# Altium schematic sheet CV_Beta.schdoc
size 307 x 218 mm; Symbol: Drawing-Symbol_A4; Device: Drawing-Symbol_A4; @Project Name: CV_ver0309; @Page Count: 1; @Update Date: 2025-03-09; @Create Date: 2025-03-09; @Schematic Name: Schematic1; @Page No: 1; @Page Name: P1; Company: EasyEDA.com; Version: V1.0; Page Size: A4; @Create Time: 07:45:37; @Update Time: 14:45:37; Width: 1170; Height: 825; Region Start: 1; X Region Count: 6; Y Region Count: 4; Blade Width: 10; Title Block Position: 3; @Board Name: Board1
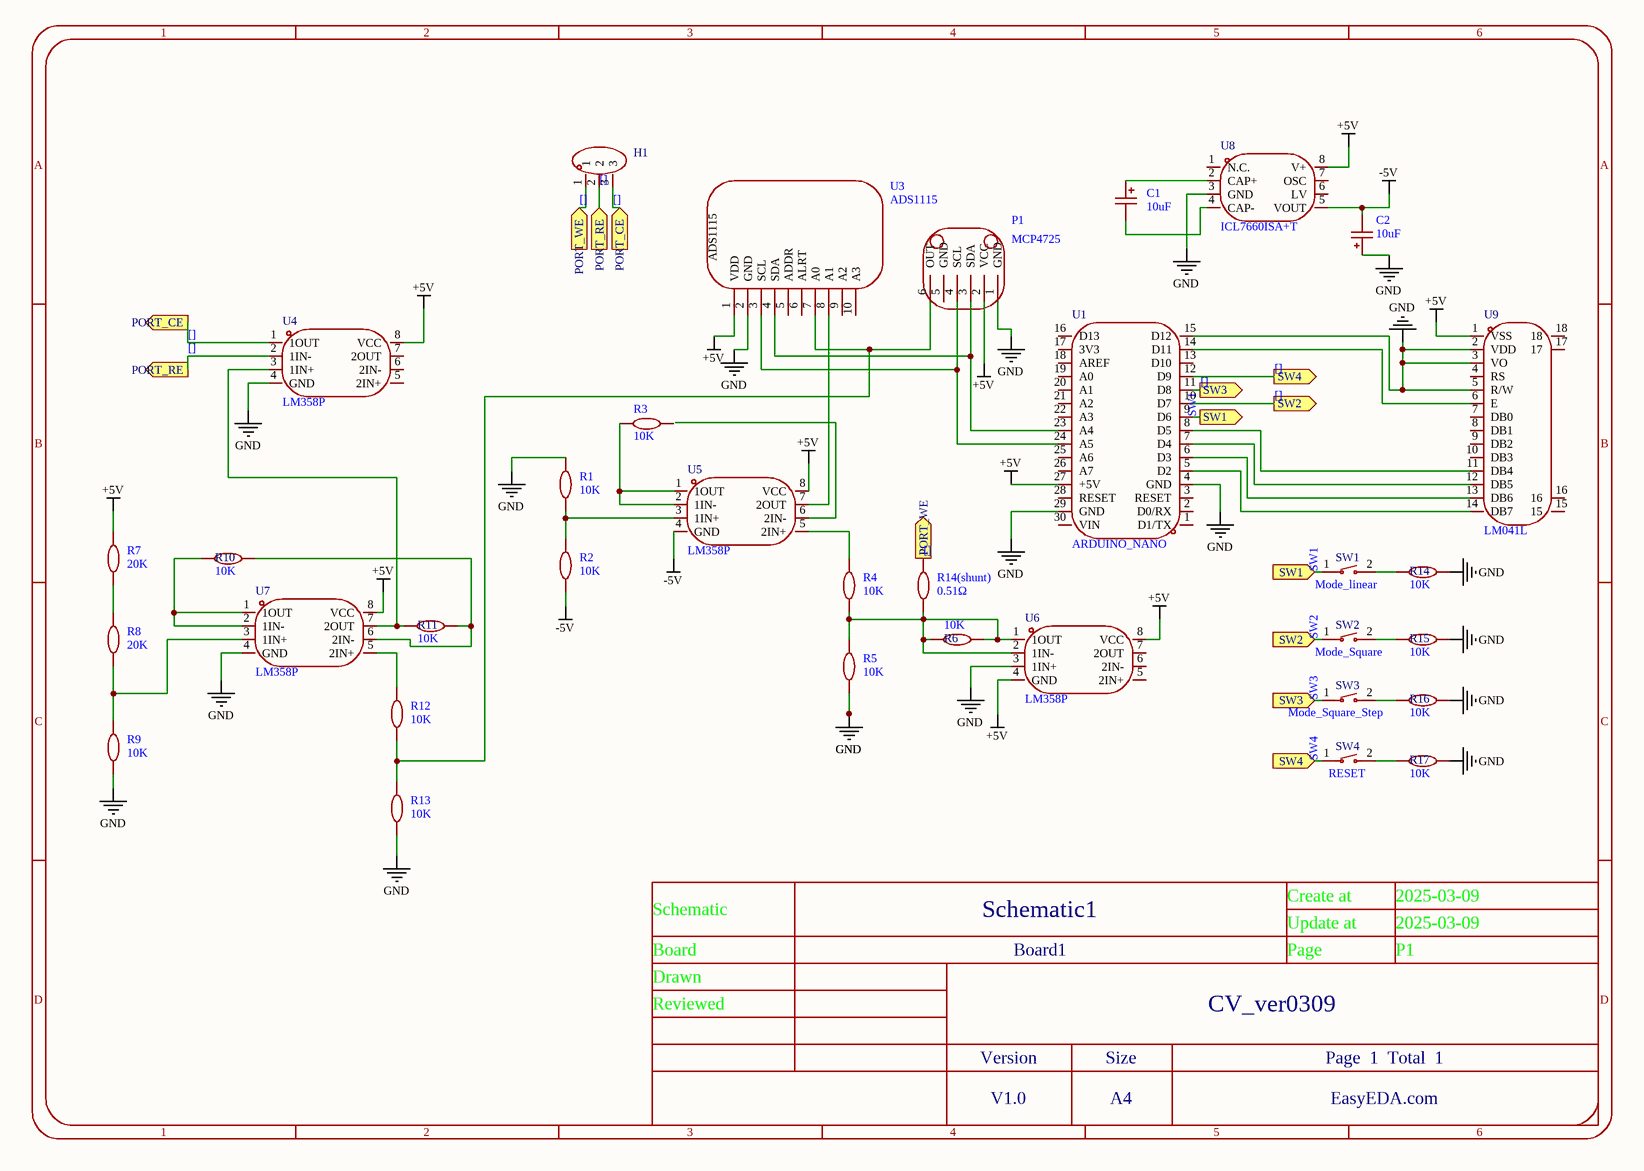
[diagram p0: CV_Beta.schdoc]

## Parts
C1  10uF  [CAP-SMD_BD3.0-L3.3-W3.3-RD]
C2  10uF  [CAP-SMD_BD3.0-L3.3-W3.3-RD]
H1  (no value)  [HDR-TH_3P-P2.54-V-F]
P1  MCP4725  [MCP4725_MODULE]
R1  10K  [R0603]
R2  10K  [R0603]
R3  10K  [R0603]
R4  10K  [R0603]
R5  10K  [R0603]
R6  10K  [R0603]
R7  20K  [R0603]
R8  20K  [R0603]
R9  10K  [R0603]
R10  10K  [R0603]
R11  10K  [R0603]
R12  10K  [R0603]
R13  10K  [R0603]
R14  10K  [R0603]
R14(shunt)  0.51Ω  [RES-TH_BD4.5-L11.5-P15.50-D0.8]
R15  10K  [R0603]
R16  10K  [R0603]
R17  10K  [R0603]
SW1  Mode_linear  [KEY-SMD_L6.0-W3.5-LS8.0]
SW2  Mode_Square  [KEY-SMD_L6.0-W3.5-LS8.0]
SW3  Mode_Square_Step  [KEY-SMD_L6.0-W3.5-LS8.0]
SW4  RESET  [KEY-SMD_L6.0-W3.5-LS8.0]
U1  ARDUINO_NANO  [COMM-TH_ARDUINO_NANO]
U3  ADS1115  [ADS1115]
U4  LM358P  [DIP-8_L9.4-W6.4-P2.54-LS9.1-BL]
U5  LM358P  [DIP-8_L9.4-W6.4-P2.54-LS9.1-BL]
U6  LM358P  [DIP-8_L9.4-W6.4-P2.54-LS9.1-BL]
U7  LM358P  [DIP-8_L9.4-W6.4-P2.54-LS9.1-BL]
U8  ICL7660ISA+T  [SOIC-8_L5.0-W4.0-P1.27-LS6.1-BL]
U9  LM041L  [LCD-TH_LM041L]

## Ports
PORT_CE (in), PORT_CE (out), PORT_RE (in), PORT_RE (out), PORT_WE (in), PORT_WE (out), SW1 (in), SW1 (out), SW2 (in), SW2 (out), SW3 (in), SW3 (out), SW4 (in), SW4 (out)

## Nets
+5V: P1.2(VCC) R7.2 U1.27(+5V) U3.1(VDD) U4.8(VCC) U5.8(VCC) U6.4(GND) U6.8(VCC) U7.8(VCC) U8.8(V+) U9.1(VSS)
-5V: C2.2 R2.1 U5.4(GND) U8.5(VOUT)
GND: C2.1 P1.1(GND) R1.2 R5.1 R9.1 R13.1 R14.2 R15.2 R16.2 R17.2 U1.4(GND) U1.15(D12) U1.29(GND) U3.2(GND) U4.4(GND) U6.3(1IN+) U7.4(GND) U8.3(GND) U9.2(VDD) U9.3(VO) U9.5(R/W)
[]: H1.1 H1.2 H1.3 R14(shunt).2 SW2.1 SW3.1 SW4.1 U1.10(D7) U1.11(D8) U1.12(D9) U4.1(1OUT) U4.2(1IN-) ; port PORT_WE, port PORT_CE, port PORT_RE, port SW2, port SW3, port SW4  [also labelled SW2, SW3, SW4]
SW1: SW1.1 U1.9(D6) ; port SW1
NetC1_1: C1.1 U8.2(CAP+)
NetC1_2: C1.2 U8.4(CAP-)
NetP1_3: P1.3(SDA) U1.23(A4) U3.4(SDA)
NetP1_4: P1.4(SCL) U1.24(A5) U3.3(SCL)
NetP1_6: P1.6(OUT) R12.1 R13.2 U3.7(A0)
NetR1_1: R1.1 R2.2 U5.3(1IN+)
NetR3_1: R3.1 U5.1(1OUT) U5.2(1IN-)
NetR4_1: R4.1 R5.2 R6.1 R6.2 R14(shunt).1 U6.1(1OUT) U6.2(1IN-)
NetR4_2: R4.2 U5.5(2IN+)
NetR7_1: R7.1 R8.2
NetR8_1: R8.1 R9.2 U7.3(1IN+)
NetR10_1: R10.1 U7.1(1OUT) U7.2(1IN-)
NetR10_2: R10.2 R11.2 U7.6(2IN-)
NetR11_1: R11.1 U4.3(1IN+) U7.7(2OUT)
NetR12_2: R12.2 U7.5(2IN+)
NetR14_1: R14.1 SW1.2
NetR15_1: R15.1 SW2.2
NetR16_1: R16.1 SW3.2
NetR17_1: R17.1 SW4.2
NetU1_5: U1.5(D2) U9.14(DB7)
NetU1_6: U1.6(D3) U9.13(DB6)
NetU1_7: U1.7(D4) U9.12(DB5)
NetU1_8: U1.8(D5) U9.11(DB4)
NetU1_14: U1.14(D11) U9.6(E)
NetU3_8: U3.8(A1) U5.7(2OUT)

Not connected (* = marked no-connect by the designer): P1 5(GND); R3 2; U1 1(D1/TX) 2(D0/RX) 3(RESET) 13(D10) 16(D13) 17(3V3) 18(AREF) 19(A0) 20(A1) 21(A2) 22(A3) 25(A6) 26(A7) 28(RESET) 30(VIN); U3 5(ADDR) 6(ALRT) 9(A2) 10(A3); U4 5(2IN+) 6(2IN-) 7(2OUT); U5 6(2IN-); U6 5(2IN+) 6(2IN-) 7(2OUT); U8 1(N.C.) 6(LV) 7(OSC); U9 4(RS) 7(DB0) 8(DB1) 9(DB2) 10(DB3) 15 16 17 18

## Notes on the sheet
- 1
- 2
- 3
- 4
- 5
- 6
- A
- B
- C
- Schematic
- Schematic1
- Create at
- Update at
- 2025-03-09
- Board
- Drawn
- Board1
- Page
- P1
- D
- Reviewed
- Version
- Size
- CV_ver0309
- Page  1  Total  1
- V1.0
- A4
- EasyEDA.com

## Library data of the parts
C1 C2 = C_Ele_SMD_3x5.4mm: Add into BOM: yes; Symbol: C_Ele_SMD; Device: C_Ele_SMD_3x5.4mm; Supplier Footprint: SMD,3x5.4mm; Convert to PCB: yes; Value: 10uF
H1 = HDR-F_2.54_1x3P: Symbol: PM254V-11-03-H85; Convert to PCB: yes; Device: HDR-F_2.54_1x3P; Add into BOM: yes; Supplier Footprint: Through
P1 = MCP4725: Add into BOM: yes; Symbol: MCP4725; Device: MCP4725; Convert to PCB: yes
R1-R17 = Res_0603: Symbol: Res; Convert to PCB: yes; Device: Res_0603; Add into BOM: yes; Supplier Footprint: 0603
  R1-R6 R9-R17: Value: 10K
  R7 R8: Value: 20K
R14(shunt) = Res_AXIAL-1W: Symbol: Res; Convert to PCB: yes; Device: Res_AXIAL-1W; Add into BOM: yes; Supplier Footprint: Through; Value: 0.51Ω
SW1-SW4 = BUTTON2,KEY: Add into BOM: yes; Symbol: BUTTON2,KEY; Device: BUTTON2,KEY; LCSC Part Name: BUTTON2,KEY; Supplier Part: C9900020455; Supplier Footprint: BUTTON2,KEY; JLCPCB Part Class: Extended Part; Supplier: LCSC; Convert to PCB: yes
  SW1: Manufacturer Part: Mode_linear
  SW2: Manufacturer Part: Mode_Square
  SW3: Manufacturer Part: Mode_Square_Step
  SW4: Manufacturer Part: RESET
U1 = ARDUINO_NANO: Add into BOM: yes; Symbol: ARDUINO_NANO; Device: ARDUINO_NANO; LCSC Part Name: ARDUINO_NANO; Supplier Part: C9900017879; Manufacturer Part: ARDUINO_NANO; Supplier Footprint: 插件; JLCPCB Part Class: Extended Part; Supplier: LCSC; Convert to PCB: yes
U3 = ADS1115: Add into BOM: yes; Symbol: ADS1115; Device: ADS1115; Convert to PCB: yes
U4-U7 = LM358P: Manufacturer: TI(德州仪器); Add into BOM: yes; Number of Circuits: Dual; Gain Bandwidth Product(GBP): 700kHz; Slew Rate(SR): 0.3V/us; Current - Input Bias(Ib): 20nA; Quiescent Current: 1mA; Output Current: 40mA; Symbol: LM358P; Device: LM358P; LCSC Part Name: 双通道运算放大器; Supplier Part: C5213; Manufacturer Part: LM358P; Supplier Footprint: DIP-8; JLCPCB Part Class: Extended Part; Datasheet: http://www.ti.com/cn/lit/gpn/lm358; Supplier: LCSC; Convert to PCB: yes; Operating Temperature: 0℃~+70℃
U8 = ICL7660ISA+T: Manufacturer: ADI(亚德诺)/MAXIM(美信); Add into BOM: yes; Symbol: ICL7660ISA+T; Device: ICL7660ISA+T; LCSC Part Name: ICL7660ISA+T; Supplier Part: C2072514; Manufacturer Part: ICL7660ISA+T; Supplier Footprint: SOIC-8; JLCPCB Part Class: Extended Part; Datasheet: https://atta.szlcsc.com/upload/public/pdf/source/20191209/C407899_F02514FE12C1148958261B7B463B7B63.pdf; Supplier: LCSC; Convert to PCB: yes
U9 = LM041L: Add into BOM: yes; Symbol: LM041L; Device: LM041L; LCSC Part Name: LM041L; Supplier Part: C9900085621; Manufacturer Part: LM041L; Supplier Footprint: LCD-1602; JLCPCB Part Class: Extended Part; Supplier: LCSC; Convert to PCB: yes